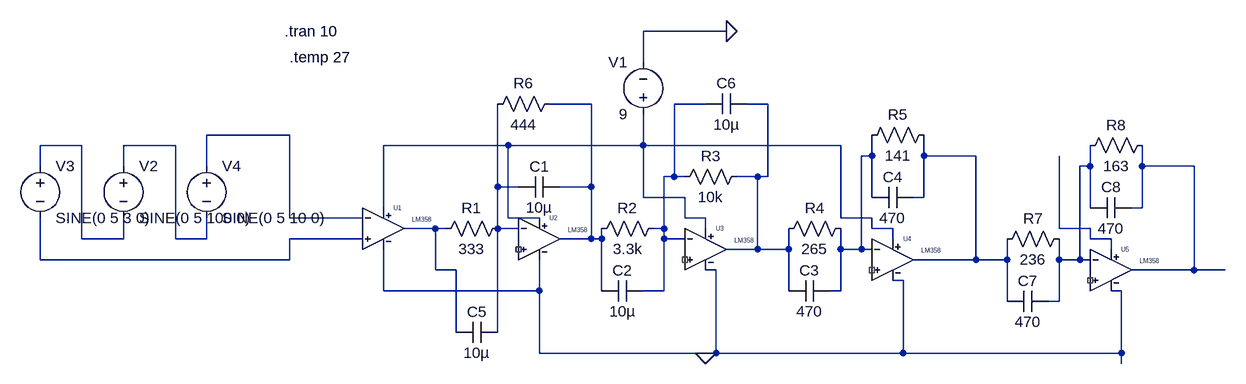
[diagram p0: schematic filter.asc]
filter.asc, the LTspice schematic file:
Version 4
SHEET 1 1300 680
WIRE 528 -528 400 -528
WIRE 400 -480 400 -528
WIRE 320 -416 256 -416
WIRE 496 -416 448 -416
WIRE 592 -416 560 -416
WIRE -144 -368 -272 -368
WIRE -464 -352 -528 -352
WIRE -320 -352 -400 -352
WIRE 192 -352 0 -352
WIRE 400 -352 400 -400
WIRE 400 -352 192 -352
WIRE 704 -352 400 -352
WIRE 752 -336 752 -368
WIRE 752 -336 736 -336
WIRE 832 -336 832 -368
WIRE 912 -336 832 -336
WIRE -528 -320 -528 -352
WIRE -400 -320 -400 -352
WIRE -272 -320 -272 -368
WIRE 1088 -320 1088 -352
WIRE 1088 -320 1072 -320
WIRE 1168 -320 1168 -352
WIRE 1248 -320 1168 -320
WIRE 448 -304 448 -416
WIRE 448 -304 432 -304
WIRE 464 -304 448 -304
WIRE 576 -304 544 -304
WIRE 592 -304 592 -416
WIRE 592 -304 576 -304
WIRE 176 -288 176 -416
WIRE 208 -288 176 -288
WIRE 320 -288 320 -416
WIRE 320 -288 272 -288
WIRE 400 -272 400 -352
WIRE 464 -272 400 -272
WIRE 752 -272 752 -336
WIRE 832 -272 832 -336
WIRE 832 -272 816 -272
WIRE 0 -256 0 -352
WIRE 1088 -256 1088 -320
WIRE 1168 -256 1168 -320
WIRE 1168 -256 1152 -256
WIRE -144 -240 -144 -368
WIRE -32 -240 -144 -240
WIRE 192 -240 192 -352
WIRE 240 -240 192 -240
WIRE 464 -240 464 -272
WIRE 496 -240 464 -240
WIRE 704 -240 704 -352
WIRE 752 -240 704 -240
WIRE 80 -224 32 -224
WIRE 96 -224 80 -224
WIRE 176 -224 176 -288
WIRE 208 -224 176 -224
WIRE 432 -224 432 -304
WIRE 432 -224 416 -224
WIRE 496 -224 496 -240
WIRE 752 -224 752 -240
WIRE 784 -224 752 -224
WIRE 1040 -224 1040 -336
WIRE 1088 -224 1040 -224
WIRE -464 -208 -464 -352
WIRE -400 -208 -400 -240
WIRE -400 -208 -464 -208
WIRE -320 -208 -320 -352
WIRE -272 -208 -272 -240
WIRE -272 -208 -320 -208
WIRE -32 -208 -144 -208
WIRE 320 -208 320 -288
WIRE 320 -208 272 -208
WIRE 336 -208 336 -224
WIRE 336 -208 320 -208
WIRE 432 -208 432 -224
WIRE 464 -208 432 -208
WIRE 784 -208 784 -224
WIRE 1088 -208 1088 -224
WIRE 1120 -208 1088 -208
WIRE 576 -192 576 -304
WIRE 576 -192 528 -192
WIRE 624 -192 624 -224
WIRE 624 -192 576 -192
WIRE 704 -192 704 -224
WIRE 736 -192 736 -336
WIRE 736 -192 704 -192
WIRE 752 -192 736 -192
WIRE 1120 -192 1120 -208
WIRE -528 -176 -528 -240
WIRE -144 -176 -144 -208
WIRE -144 -176 -528 -176
WIRE 912 -176 912 -336
WIRE 912 -176 816 -176
WIRE 960 -176 960 -208
WIRE 960 -176 912 -176
WIRE 1040 -176 1040 -208
WIRE 1072 -176 1072 -320
WIRE 1072 -176 1040 -176
WIRE 1088 -176 1072 -176
WIRE 80 -160 80 -224
WIRE 112 -160 80 -160
WIRE 512 -160 496 -160
WIRE 1248 -160 1248 -320
WIRE 1248 -160 1152 -160
WIRE 1296 -160 1248 -160
WIRE 800 -144 784 -144
WIRE 0 -128 0 -192
WIRE 240 -128 240 -176
WIRE 240 -128 0 -128
WIRE 336 -128 336 -208
WIRE 432 -128 432 -208
WIRE 432 -128 400 -128
WIRE 624 -128 624 -192
WIRE 704 -128 704 -192
WIRE 704 -128 688 -128
WIRE 1136 -128 1120 -128
WIRE 960 -112 960 -176
WIRE 1040 -112 1040 -176
WIRE 1040 -112 1024 -112
WIRE 112 -64 112 -160
WIRE 176 -64 176 -224
WIRE 240 -32 240 -128
WIRE 496 -32 240 -32
WIRE 512 -32 512 -160
WIRE 512 -32 496 -32
WIRE 800 -32 800 -144
WIRE 800 -32 512 -32
WIRE 1136 -32 1136 -128
WIRE 1136 -32 800 -32
WIRE 1136 -16 1136 -32
FLAG 496 -32 0
FLAG 528 -528 0
SYMBOL lm358 0 -288 R0
SYMATTR InstName U1
SYMBOL lm358 240 -272 R0
SYMATTR InstName U2
SYMBOL lm358 496 -256 R0
SYMATTR InstName U3
SYMBOL lm358 784 -240 R0
SYMATTR InstName U4
SYMBOL res 192 -240 R90
WINDOW 0 0 56 VBottom 2
WINDOW 3 32 56 VTop 2
SYMATTR InstName R1
SYMATTR Value 333
SYMBOL cap 208 -272 R270
WINDOW 0 32 32 VTop 2
WINDOW 3 0 32 VBottom 2
SYMATTR InstName C1
SYMATTR Value 10µ
SYMBOL res 432 -240 R90
WINDOW 0 0 56 VBottom 2
WINDOW 3 32 56 VTop 2
SYMATTR InstName R2
SYMATTR Value 3.3k
SYMBOL cap 400 -144 R90
WINDOW 0 0 32 VBottom 2
WINDOW 3 32 32 VTop 2
SYMATTR InstName C2
SYMATTR Value 10µ
SYMBOL res 560 -320 R90
WINDOW 0 0 56 VBottom 2
WINDOW 3 32 56 VTop 2
SYMATTR InstName R3
SYMATTR Value 10k
SYMBOL res 720 -240 R90
WINDOW 0 0 56 VBottom 2
WINDOW 3 32 56 VTop 2
SYMATTR InstName R4
SYMATTR Value 265
SYMBOL cap 688 -144 R90
WINDOW 0 0 32 VBottom 2
WINDOW 3 32 32 VTop 2
SYMATTR InstName C3
SYMATTR Value 470
SYMBOL res 848 -384 R90
WINDOW 0 0 56 VBottom 2
WINDOW 3 32 56 VTop 2
SYMATTR InstName R5
SYMATTR Value 141
SYMBOL cap 816 -288 R90
WINDOW 0 0 32 VBottom 2
WINDOW 3 32 32 VTop 2
SYMATTR InstName C4
SYMATTR Value 470
SYMBOL voltage 400 -384 R180
WINDOW 0 24 96 Left 2
WINDOW 3 24 16 Left 2
WINDOW 123 0 0 Left 0
WINDOW 39 0 0 Left 0
SYMATTR InstName V1
SYMATTR Value 9
SYMBOL voltage -400 -336 R0
WINDOW 123 0 0 Left 0
WINDOW 39 0 0 Left 0
SYMATTR InstName V2
SYMATTR Value SINE(0 5 100 0)
SYMBOL voltage -528 -336 R0
WINDOW 123 0 0 Left 0
WINDOW 39 0 0 Left 0
SYMATTR InstName V3
SYMATTR Value SINE(0 5 3 0)
SYMBOL voltage -272 -336 R0
WINDOW 123 0 0 Left 0
WINDOW 39 0 0 Left 0
SYMATTR InstName V4
SYMATTR Value SINE(0 5 10 0)
SYMBOL res 272 -432 R90
WINDOW 0 0 56 VBottom 2
WINDOW 3 32 56 VTop 2
SYMATTR InstName R6
SYMATTR Value 444
SYMBOL cap 176 -80 R90
WINDOW 0 0 32 VBottom 2
WINDOW 3 32 32 VTop 2
SYMATTR InstName C5
SYMATTR Value 10µ
SYMBOL cap 560 -432 R90
WINDOW 0 0 32 VBottom 2
WINDOW 3 32 32 VTop 2
SYMATTR InstName C6
SYMATTR Value 10µ
SYMBOL lm358 1120 -224 R0
SYMATTR InstName U5
SYMBOL res 1056 -224 R90
WINDOW 0 0 56 VBottom 2
WINDOW 3 32 56 VTop 2
SYMATTR InstName R7
SYMATTR Value 236
SYMBOL cap 1024 -128 R90
WINDOW 0 0 32 VBottom 2
WINDOW 3 32 32 VTop 2
SYMATTR InstName C7
SYMATTR Value 470
SYMBOL res 1184 -368 R90
WINDOW 0 0 56 VBottom 2
WINDOW 3 32 56 VTop 2
SYMATTR InstName R8
SYMATTR Value 163
SYMBOL cap 1152 -272 R90
WINDOW 0 0 32 VBottom 2
WINDOW 3 32 32 VTop 2
SYMATTR InstName C8
SYMATTR Value 470
TEXT -152 -528 Left 2 !.tran 10
TEXT -144 -488 Left 2 !.temp 27

The netlist it stands for:
* filter.asc
XU1 N015 N004 N007 0 N013 LM358  ; pins In+ In- V+ V- OUT
XU2 NC_01 N012 N007 0 N001 LM358  ; pins In+ In- V+ V- OUT
XU3 NC_02 N002 N007 0 N003 LM358  ; pins In+ In- V+ V- OUT
XU4 NC_03 N008 N007 0 N009 LM358  ; pins In+ In- V+ V- OUT
R1 N012 N013 333
C1 N012 N001 10µ
R2 N002 N001 3.3k
C2 N002 N001 10µ
R3 N003 N002 10k
R4 N008 N003 265
C3 N008 N003 470
R5 N009 N008 141
C4 N009 N008 470
V1 N007 0 9
V2 N006 N005 SINE(0 5 100 0)
V3 N005 N015 SINE(0 5 3 0)
V4 N004 N006 SINE(0 5 10 0)
R6 N001 N012 444
C5 N012 N013 10µ
C6 N003 N002 10µ
XU5 NC_04 N010 N014 0 N011 LM358  ; pins In+ In- V+ V- OUT
R7 N010 N009 236
C7 N010 N009 470
R8 N011 N010 163
C8 N011 N010 470
.tran 10
.temp 27
.lib LM358.MOD
.backanno
.end